# EAGLE schematic CiTEsch2 (EAGLE 9.6.2)
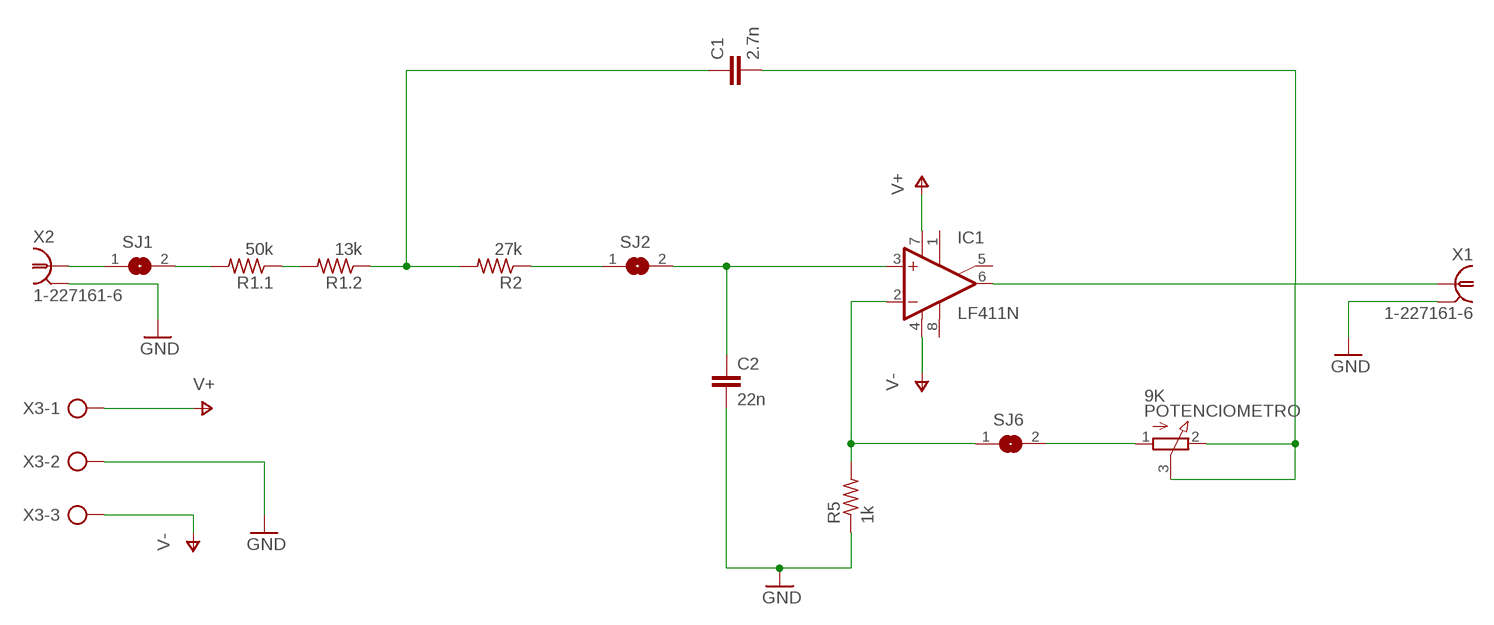
[diagram p0: schematic, sheet 1]

## Parts
9K  POTENCIOMETRO  [TSM4YJ]
C1  2.7n  C-EU050-025X075  [C050-025X075]
C2  22n  C-EU050-025X075  [C050-025X075]
IC1  LF411N  [DIL08]
R1.1  50k  R-US_0207/10  [0207/10]
R1.2  13k  R-US_0207/10  [0207/10]
R2  27k  R-US_0207/10  [0207/10]
R5  1k  R-US_0207/10  [0207/10]
SJ1  SJW  [SJW]
SJ2  SJW  [SJW]
SJ6  SJW  [SJW]
X1  1-227161-6  [AMP_227161]
X2  1-227161-6  [AMP_227161]
X3  AK500/3  [AK500/3]

## Nets
GND: C2.2 R5.1 X1.2 X2.2 X3.2
N$1: SJ1.1 X2.1
N$2: R1.1.2 SJ1.2
N$3: 9K.2(E) 9K.3(S) C1.2 IC1.6(OUT) X1.1
N$4: R1.1.1 R1.2.2
N$5: C1.1 R1.2.1 R2.2
N$6: 9K.1(A) SJ6.2
N$7: IC1.2(-IN) R5.2 SJ6.1
N$10: R2.1 SJ2.1
N$11: C2.1 IC1.3(+IN) SJ2.2
V+: IC1.7(V+) X3.1
V-: IC1.4(V-) X3.3
Unconnected: IC1.1(ON1) IC1.5(ON2) IC1.8(OPT)

## Library data of the parts
9K = POTENCIOMETRO:POTENCIOMETRO
C1 C2 = rcl:C-EU: CAPACITOR, European symbol; SPICEPREFIX: C
IC1 = linear:LF411: OP AMP
R1.1 R1.2 R2 R5 = rcl:R-US_: RESISTOR, American symbol; SPICEPREFIX: R
SJ1 SJ2 SJ6 = jumper:SJ: SMD solder JUMPER
X1 X2 = con-coax:?227161*: JACK, RIGHT ANGLE, 50 OHM, PCB, BNC Source: amp_227161.pdf; MF: TYCO ELECTRONICS; MPN: 1-227161-6; OC_FARNELL: unknown; OC_NEWARK: 09H7854
X3 = con-ptr500:AK500/3: CONNECTOR; OC_FARNELL: unknown; OC_NEWARK: unknown